# Altium schematic sheet [07]-SDcard_Testpoints_Ext_SPI_Interface.SchDoc: SD card Test points and External SPI Interface
size A4; Date: 09/02/2019; Author: Faheem Minhas; Organization: PhasePhotonics; SheetNumber: 11; SheetTotal: 20
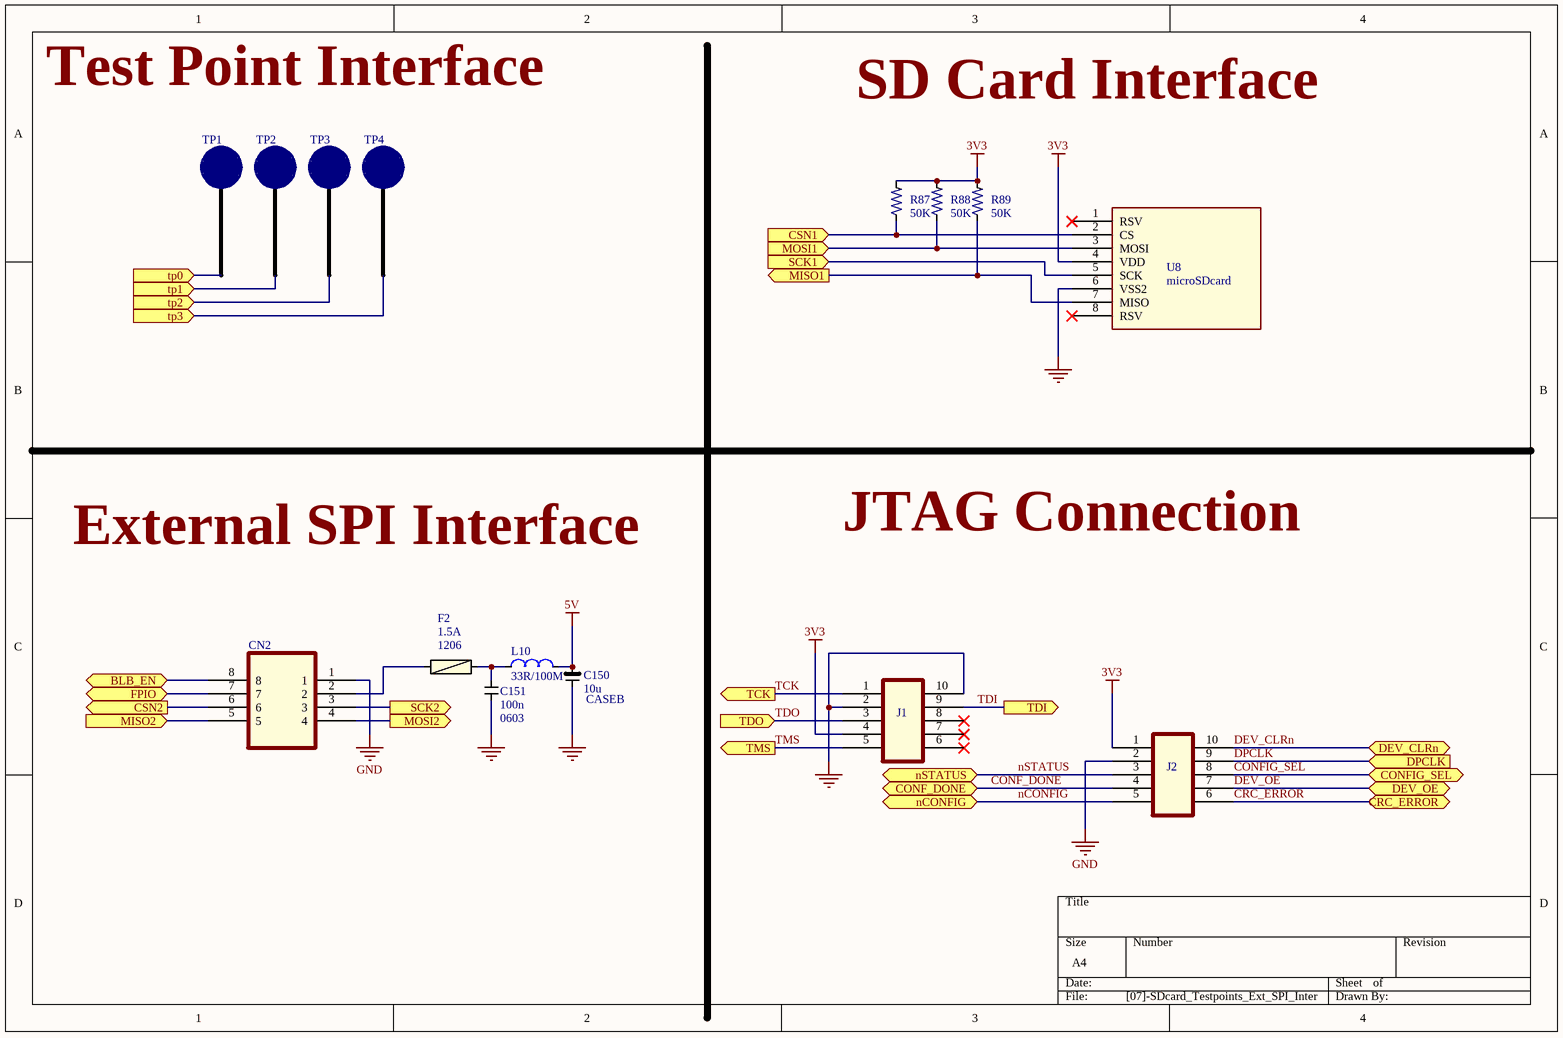
[diagram p0: [07]-SDcard_Testpoints_Ext_SPI_Interface.SchDoc]

## Parts
C150  10u  PCB layer: CASEB  [CAPC3528X21N]
C151  100n  PCB footprint: 0603
CN2  SPI_connector  [TE_7-215079-8_0]  (value not drawn)
F2  1.5A  PCB type: 1206  [*CAP3216X125N]
J1  1761681-3  [Harwin_Inc._M50-3500542_0]  (value not drawn)
J2  1761681-3  [Harwin_Inc._M50-3500542_0]  (value not drawn)
L10  33R/100M  [*FB_BLM18PG121SN1D]
R87  50K  [*RESC1608X60N]
R88  50K  [*RESC1608X60N]
R89  50K  [*RESC1608X60N]
TP1  TEST-7CN  [PCBComponent_1]  (value not drawn)
TP2  TEST-7CN  [PCBComponent_1]  (value not drawn)
TP3  TEST-7CN  [PCBComponent_1]  (value not drawn)
TP4  TEST-7CN  [PCBComponent_1]  (value not drawn)
U8  microSDcard  [*MOLEX_500901-0801_500901-0801(Primary)]

## Ports
BLB_EN (bidir), CONF_DONE (bidir), CONFIG_SEL (bidir), CRC_ERROR (bidir), CSN1 (in), CSN2 (out), DEV_CLRn (bidir), DEV_OE (bidir), DPCLK (in), FPIO (bidir), MISO1 (out), MISO2 (in), MOSI1 (in), MOSI2 (out), nCONFIG (bidir), nSTATUS (bidir), SCK1 (in), SCK2 (out), TCK (out), TDI (out), TDO (in), TMS (out), tp0 (in), tp1 (in), tp2 (in), tp3 (in)

## Nets
3V3: J1.4 J2.1 R87.2 R88.2 R89.2 U8.4(VDD)
5V: C150.1 L10.2
GND: C150.2 C151.1 CN2.1 J1.2 J1.10 J2.2 U8.6(VSS2)
BLB_EN: CN2.8 ; port BLB_EN
CONF_DONE: J2.4 ; port CONF_DONE
CONFIG_SEL: J2.8 ; port CONFIG_SEL
CRC_ERROR: J2.6 ; port CRC_ERROR
CSN1: R87.1 U8.2(CS) ; port CSN1
CSN2: CN2.6 ; port CSN2
DEV_CLRn: J2.10 ; port DEV_CLRn
DEV_OE: J2.7 ; port DEV_OE
DPCLK: J2.9 ; port DPCLK
FPIO: CN2.7 ; port FPIO
MISO1: R89.1 U8.7(MISO) ; port MISO1
MISO2: CN2.5 ; port MISO2
MOSI1: R88.1 U8.3(MOSI) ; port MOSI1
MOSI2: CN2.4 ; port MOSI2
nCONFIG: J2.5 ; port nCONFIG
nSTATUS: J2.3 ; port nSTATUS
SCK1: U8.5(SCK) ; port SCK1
SCK2: CN2.3 ; port SCK2
TCK: J1.1 ; port TCK
TDI: J1.9 ; port TDI
TDO: J1.3 ; port TDO
TMS: J1.5 ; port TMS
tp0: TP1.1 ; port tp0
tp1: TP2.1 ; port tp1
tp2: TP3.1 ; port tp2
tp3: TP4.1 ; port tp3
NetC151_2: C151.2 L10.1
NetCN2_2: CN2.2 F2.1

Not connected (* = marked no-connect by the designer): F2 2; J1 6* 7* 8*; U8 1(RSV)* 8(RSV)*

## Notes on the sheet
- Test Point Interface
- SD Card Interface
- External SPI Interface
- JTAG Connection

## Library data of the parts
C150 C151 F2 L10 TP1-TP4 = Component_1
  C151: Buying URL:: https://uk.farnell.com/avx/06031c104kat2a/cap-0-1-f-100v-10-x7r-0603/dp/2749806?st=100nf
  F2: Buying URL:: https://uk.farnell.com/murata/blm31pg601sn1l/ferrite-bead-600r-1-5a-1206/dp/2672840
  L10: Buying URL:: https://uk.farnell.com/murata/blm18pg330sn1d/ferrite-bead-0-025ohm-3a-0603/dp/1515742?st=Ferrite%2033R/100MHz,%2025%25,%203A,%2025mR,%200603
  TP1-TP4: Buying URL:: https://www.toby.co.uk/pcb-hardware/test-points-and-pins/test-7cn-valcon-ceramic-body-loop-pcb-test-points/
CN2 = Conn_TE_7-215079-8_eec: CONN FMALE-ON-BRD 8POS VERT T/H; Buying URL:: https://uk.farnell.com/amp-te-connectivity/7-215079-8/receptacle-idc-1-27mm-8way/dp/148593
J1 J2 = 1761681-3: IDC LOW PRO HDR 10P VERT HT BLACK; MF: hARWIN; MP: M50-3500542
R87-R89 = RP73D1J76R8BTDG: Res Thin Film 0603 76.8 Ohm 0.1% 1/10W Â±15ppm/Â°C Molded SMD Paper T/R; MF: TE Connectivity / Holsworthy; Design by: Faheem; foot print: 3X0603; Price: None; MP: RP73D1J76R8BTDG; Package: 0603 TE Connectivity / AMP; SnapEDA_Link: https://www.snapeda.com/parts/RP73D1J76R8BTDG/TE%20Connectivity%20/%20Holsworthy/view-part/?ref=snap; Value: *; Buying URL:: https://uk.farnell.com/vishay/crcw0603200kfkea/res-200k-1-0-1w-0603-thick-film/dp/1469776?st=200k%200603%20resistir; Availability: Unavailable
U8 = 500901-0801: Conn.; IC Socket; Memory Card; 1.10mm Pitch; TransFlash; Hinge Type; Round Corner Top; MF: Molex; Availability: Unavailable; Package: None; Price: None; SnapEDA_Link: https://www.snapeda.com/parts/500901-0801/Molex/view-part/?ref=snap; MP: 500901-0801; Value: *; Buying URL:: https://uk.farnell.com/molex/500901-0801/connector-micro-sd-8pos/dp/1344008?st=500901-0801